# EAGLE schematic flashlight (EAGLE 7.6.0)
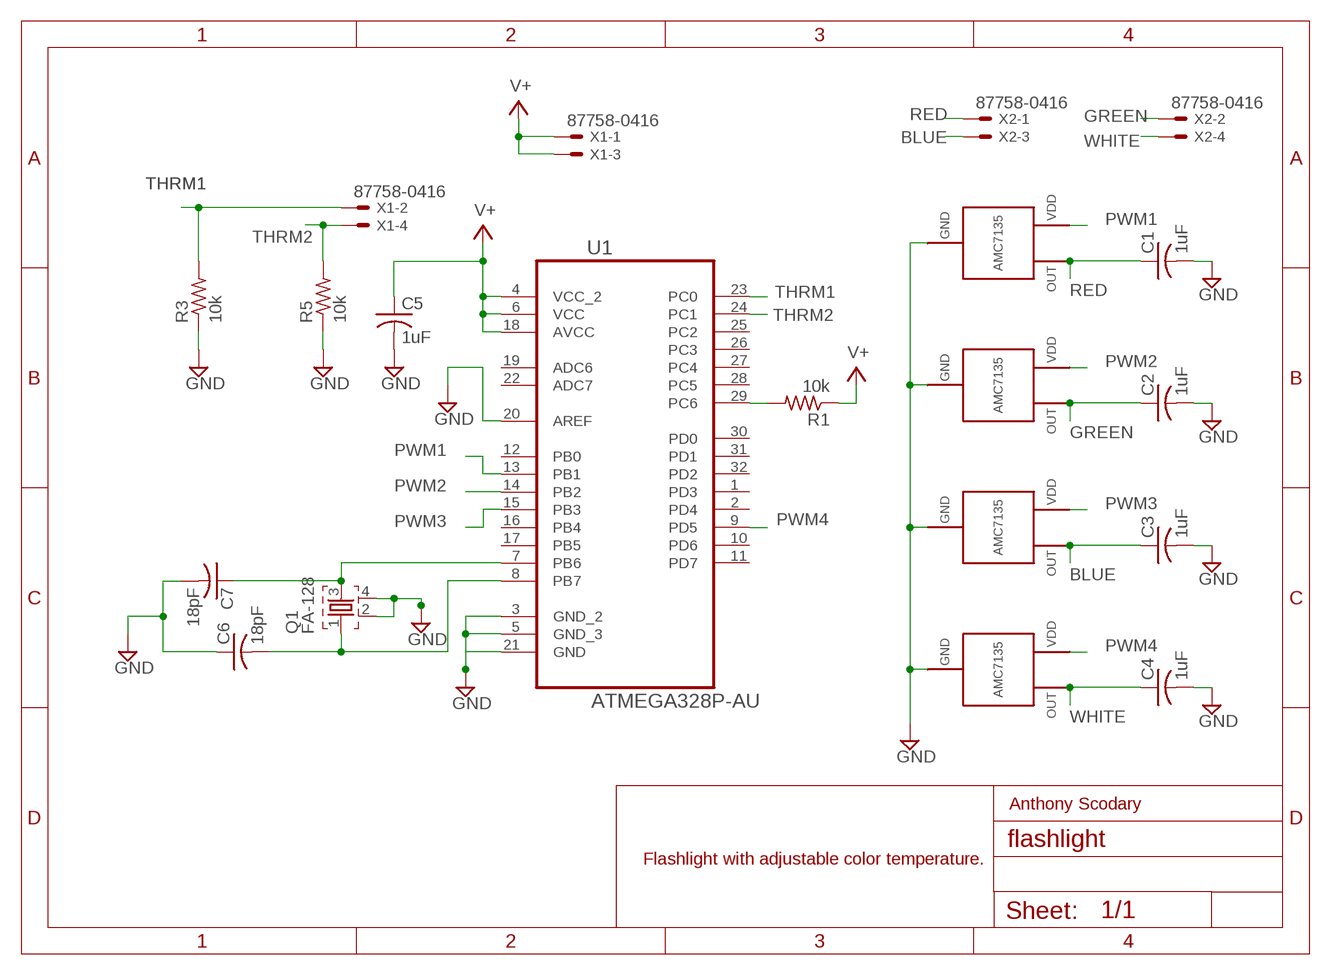
[diagram p0: schematic, sheet 1]

## Parts
C1  1uF  C-USC0805  [C0805]
C2  1uF  C-USC0805  [C0805]
C3  1uF  C-USC0805  [C0805]
C4  1uF  C-USC0805  [C0805]
C5  1uF  C-USC0805  [C0805]
C6  18pF  C-USC0805  [C0805]
C7  18pF  C-USC0805  [C0805]
Q1  FA-128  [FA-128]
R1  10k  R-US_R0805  [R0805]
R3  10k  R-US_R0805  [R0805]
R5  10k  R-US_R0805  [R0805]
U1  ATMEGA328P-AU  [QFP80P900X900X120-32N]
U$1  AMC7135_CC_REGULATOR  [AMC7135_CC_REGULATOR]
U$2  AMC7135_CC_REGULATOR  [AMC7135_CC_REGULATOR]
U$3  AMC7135_CC_REGULATOR  [AMC7135_CC_REGULATOR]
U$4  AMC7135_CC_REGULATOR  [AMC7135_CC_REGULATOR]
X1  87758-0416  [87758-0416]
X2  87758-0416  [87758-0416]

## Nets
BLUE: C3.1 U$3.OUT X2.3
GND: C1.2 C2.2 C3.2 C4.2 C5.2 C6.1 C7.2 Q1.2 Q1.4 R3.1 R5.1 U1.3(GND_2) U1.5(GND_3) U1.20(AREF) U1.21(GND) U$1.GND2(GND) U$1.GND3(GND) U$2.GND2(GND) U$2.GND3(GND) U$3.GND2(GND) U$3.GND3(GND) U$4.GND2(GND) U$4.GND3(GND)
GREEN: C2.1 U$2.OUT X2.2
N$1: C6.2 Q1.1 U1.8(PB7)
N$3: C7.1 Q1.3 U1.7(PB6)
N$4: R1.2 U1.29(PC6)
PWM1: U1.13(PB1) U$1.VDD
PWM2: U1.14(PB2) U$2.VDD
PWM3: U1.15(PB3) U$3.VDD
PWM4: U1.9(PD5) U$4.VDD
RED: C1.1 U$1.OUT X2.1
THRM1: R3.2 U1.23(PC0) X1.2
THRM2: R5.2 U1.24(PC1) X1.4
V+: C5.1 R1.1 U1.4(VCC_2) U1.6(VCC) U1.18(AVCC) X1.1 X1.3
WHITE: C4.1 U$4.OUT X2.4
Unconnected: U1.1(PD3) U1.2(PD4) U1.10(PD6) U1.11(PD7) U1.12(PB0) U1.16(PB4) U1.17(PB5) U1.19(ADC6) U1.22(ADC7) U1.25(PC2) U1.26(PC3) U1.27(PC4) U1.28(PC5) U1.30(PD0) U1.31(PD1) U1.32(PD2)

## Notes on the sheet
- Anthony Scodary
- Flashlight with adjustable color temperature.

## Library data of the parts
C1-C7 = adafruit:C-US: CAPACITOR, American symbol
Q1 = crystal:FA-: MHz RANGE CRYSTAL UNIT Source: Epson Toyocom
R1 R3 R5 = adafruit:R-US_: RESISTOR, American symbol
U1 = Atmel_By_element14_Batch_1-00:ATMEGA328P-AU: 8-bit Microcontroller with In-System Programmable Flash; MPN: ATMEGA328P-AU; OC_FARNELL: 1715486; OC_NEWARK: 14R4631; PACKAGE: TQFP-32; SUPPLIER: Atmel
U$1-U$4 = AMC7135_CC_Regulator:AMC7135_CC_REGULATOR
X1 X2 = con-molex:87758-0416: 4 Pin - 2mm Dual Row Single Wafer, Vertical T/H HDR Source: http://www.molex.com/pdm_docs/sd/877580616_sd.pdf; MF: FARNELL; MPN: 87758-0416; OC_FARNELL: 7472315; OC_NEWARK: 39K3681